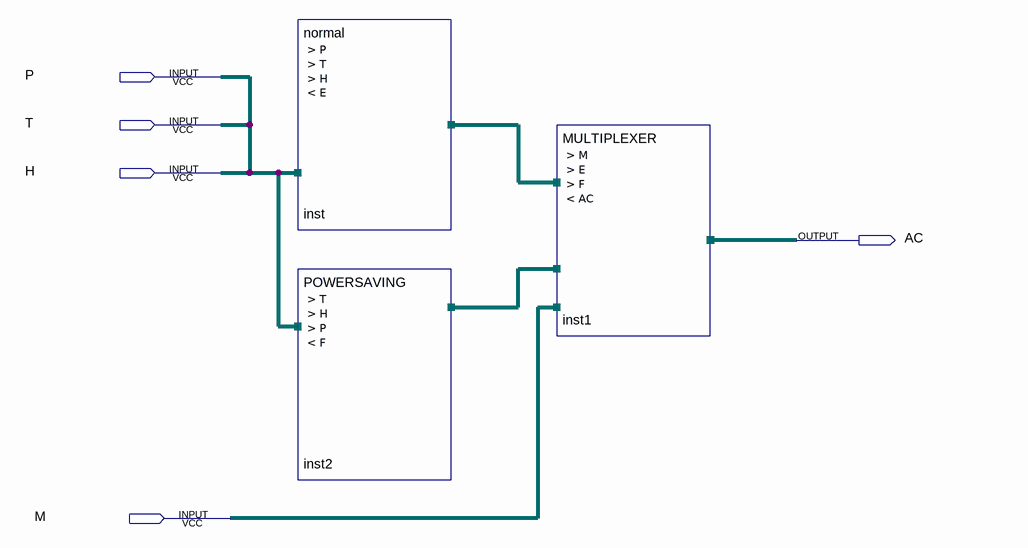
[diagram p0: schematic sheet]
// Quartus schematic lab4step2.bdf as structural Verilog: 3 symbols, 5 pins
module lab4step2 (
  input  P,
  input  T,
  input  H,
  input  M,
  output AC
);

  wire E, F;

  normal inst (.P(P), .T(T), .H(H), .E(E));
  POWERSAVING inst2 (.T(T), .H(H), .P(P), .F(F));
  MULTIPLEXER inst1 (.M(M), .E(E), .F(F), .AC(AC));
endmodule
